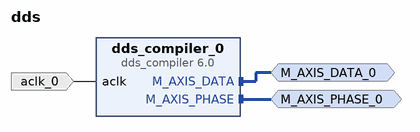
[diagram p0: block diagram of the top level]
# Vivado block design dds, xc7a100tfgg484-2, Vivado 2018.3
create_bd_design dds

create_bd_intf_port -mode Master -vlnv xilinx.com:interface:axis_rtl:1.0 M_AXIS_DATA_0
create_bd_intf_port -mode Master -vlnv xilinx.com:interface:axis_rtl:1.0 M_AXIS_PHASE_0
create_bd_port -dir I -type clk aclk_0

create_bd_cell -type ip -vlnv xilinx.com:ip:dds_compiler:6.0 dds_compiler_0
set_property -dict [list \
  CONFIG.DATA_Has_TLAST Not_Required \
  CONFIG.Frequency_Resolution 0.1 \
  CONFIG.Has_Phase_Out true \
  CONFIG.Has_TREADY true \
  CONFIG.Latency 6 \
  CONFIG.M_DATA_Has_TUSER Not_Required \
  CONFIG.Noise_Shaping None \
  CONFIG.Output_Frequency1 0 \
  CONFIG.Output_Selection Sine \
  CONFIG.Output_Width 8 \
  CONFIG.PINC1 1 \
  CONFIG.Parameter_Entry Hardware_Parameters \
  CONFIG.PartsPresent Phase_Generator_and_SIN_COS_LUT \
  CONFIG.Phase_Increment Fixed \
  CONFIG.Phase_Width 16 \
  CONFIG.Phase_offset Fixed \
  CONFIG.S_PHASE_Has_TUSER Not_Required \
] [get_bd_cells dds_compiler_0]

# ---- connections ----

connect_bd_intf_net [get_bd_intf_ports M_AXIS_DATA_0] [get_bd_intf_pins dds_compiler_0/M_AXIS_DATA]
connect_bd_intf_net [get_bd_intf_ports M_AXIS_PHASE_0] [get_bd_intf_pins dds_compiler_0/M_AXIS_PHASE]
connect_bd_net -net aclk_0_1 [get_bd_ports aclk_0] [get_bd_pins dds_compiler_0/aclk]

validate_bd_design
save_bd_design
